# Altium schematic sheet MP3.SchDoc
size A; SheetNumber: 2; SheetTotal: 3
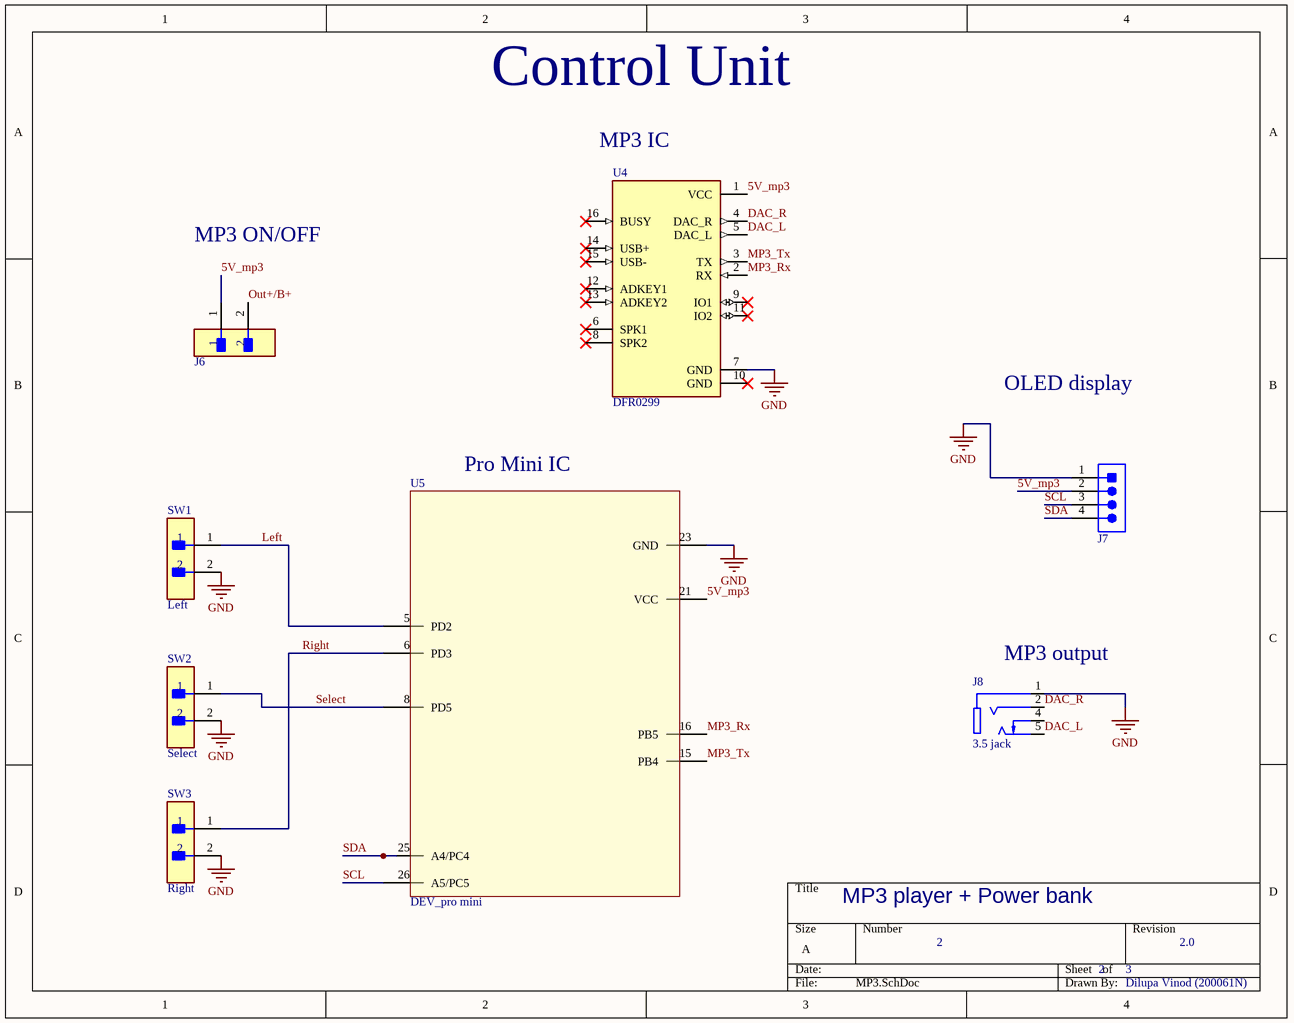
[diagram p0: MP3.SchDoc]

## Parts
J6  SW_Mp3_p  [FP-M22-2510205-MFG]  (value not drawn)
J7  OLED1  [TECO-640456-4]  (value not drawn)
J8  3.5 jack  [SWITCHCRAFT_35RAPC3BH3]
SW1  Left  [FP-M22-2510205-MFG]
SW2  Select  [FP-M22-2510205-MFG]
SW3  Right  [FP-M22-2510205-MFG]
U4  DFR0299  [MODULE_DFR0299]
U5  DEV_pro mini  [PCBComponent_1 - duplicate]

## Nets
GND: J7.1 J8.1 SW1.2 SW2.2 SW3.2 U4.7(GND) U5.23(GND)
5V_mp3: J6.1 J7.2 U4.1(VCC) U5.21(VCC)
DAC_L: J8.5 U4.5(DAC_L)
DAC_R: J8.2 U4.4(DAC_R)
Left: SW1.1 U5.5(PD2)
MP3_Rx: U4.2(RX) U5.16(PB5)
MP3_Tx: U4.3(TX) U5.15(PB4)
Out+/B+: J6.2
Right: SW3.1 U5.6(PD3)
SCL: J7.3 U5.26(A5/PC5)
SDA: J7.4 U5.25(A4/PC4)
Select: SW2.1 U5.8(PD5)

Not connected (* = marked no-connect by the designer): J8 4; U4 6(SPK1)* 8(SPK2)* 9(IO1)* 10(GND)* 11(IO2)* 12(ADKEY1)* 13(ADKEY2)* 14(USB+)* 15(USB-)* 16(BUSY)*

## Notes on the sheet
- Control Unit
- (near U4) MP3 IC
- MP3 ON/OFF
- OLED display
- Pro Mini IC
- (near J8) MP3 output
- MP3 player + Power bank
- 2
- 3
- 2.0
- Dilupa Vinod (200061N)

## Library data of the parts
J6 SW1-SW3 = CMP-15831-000005-1: CONN HEADER VERT 2POS 2MM; Manufacturer: Harwin; Manufacturer Part Number: M22-2510205; Conn Gender: Male; Current Rating: 2A; Number Of Contacts: 2; Conn Orientation: Vertical; Temperature Range Low: -40°C; Device Class L1: Connectors; ComponentLink2URL: https://cdn.harwin.com/pdfs/C018XX_M22_Series_Connectors.pdf; Temperature Range High: +105°C; Pitch: 2mm; Number Of Rows: 1; Temperature: -40°C to +105°C; Automotive: No; Device Class L3: unset; Octopart: https://octopart.com/m22-2510205-harwin-2538221; Mouser Description: Headers & Wire Housings 2 PIN SIL VERTICAL GOLD PIN HEADER; Height: 5.45mm; Category: Conn; Digikey Description: CONN HEADER VERT 2POS 2MM; Contact Material: Gold,Nickel; Lead Free: Yes; ComponentLink2Description: Datasheet; Device Class L2: Headers and Wire Housings; Package: 0; Footprint Url: https://cdn.harwin.com/pdfs/M22-251.pdf; RoHS: TRUE
J7 = CMP-2000-05419-1: Male Header, Pitch 2.54 mm, 1 x 4 Position, Height 10.03 mm, Tail Length 3.56 mm, RoHS, Bulk; Manufacturer: TE Connectivity; Manufacturer Part Number: 640456-4; Material, Housing: Polyester; Primary Type: InterconnectSystem; Mount Angle: Vertical; Color, Housing: White; Current, Rating: 5 / A; Agency Approvals: CSA,UL; Contact Termination Area Plating: Tin; Temperature, Operating: -55to+105 / degC; Standards: RoHSCompliant,ELVCompliant,UL94V-0; Number of Positions: 4; Brand/Series: MTA-100Series; Angle: Straight; Pin Spacing: 0.1 / "; Material, Contact: CopperAlloy; Connector Type: MTA-100; Special Features: Pinstrip; Mounting Hole Size: 0.04 / "; Contact Centerline Spacing: 0.100 / in.; Voltage, Rating: 250 / V; Manufacturer URL: http://www.te.com/; Length, Pin: 0.14 / "; Length, Overall: 0.4 / "; Color: White; Flammability Rating: UL94V-0; Mounting Type: PCMount; Termination: Solder; Datasheet URL: https://datasheet.ciiva.com/16286/eng-ds-82056-mta-0608-16286228.pdf; Number of Contacts: 4; Contact Shape: Square; Contact Mating Area Plating: Tin; Length, Terminal Post: 0.14 / in.; Size, Post: 0.025 / in.; Contact Plating: Tin; Type: PCBPlug; Datasheet Version: Dec-14; Number of Rows: 1
J8 = 35RAPC3BH3: 3.50mm (0.141", 1/8", Mini Plug) - Headphone Phone Jack Stereo (3 Conductor, TRS) Connector Solder; Package: None; Price: None; Value: *; MP: 35RAPC3BH3; Availability: Unavailable
U4 = DFR0299: Dfplayer - a Mini Mp3 Player; Package: None; Price: None; Value: *; MP: DFR0299; Availability: Unavailable